# Altium schematic sheet UV_board.SchDoc
size A4
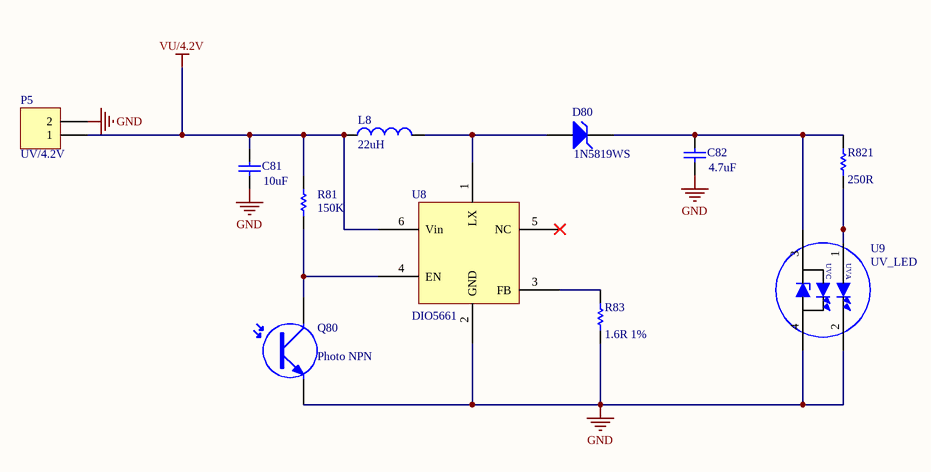
[diagram p0: UV_board.SchDoc]

## Parts
C81  value 10uF  [C0805]  (hidden comment: Cap)
C82  value 4.7uF  [C0402]  (hidden comment: Cap)
D80  1N5819WS  [SOD-323]
L8  value 22uH  [CD32]  (hidden comment: Inductor)
P5  UV/4.2V  [CON_1.25MM_2P]
Q80  Photo NPN  [PT0603]
R81  value 150K  [R0402]  (hidden comment: Res1)
R83  value 1.6R 1%  [R0402]  (hidden comment: Res1)
R821  value 250R  [R0402]  (hidden comment: Res1)
U8  DIO5661  [SOT23-6-1]
U9  UV_LED  [SH35AH]

## Nets
GND: C81.2 C82.2 P5.2 Q80.3(E) R83.1 U8.2(GND) U9.2(+) U9.4(+)
VU/4.2V: C81.1 L8.1 P5.1 R81.2 U8.6(Vin)
NetC82_1: C82.1 D80.2(K) R821.2 U9.3(+)
NetD80_1: D80.1(A) L8.2 U8.1(LX)
NetQ80_1: Q80.1(C) R81.1 U8.4(EN)
NetR83_2: R83.2 U8.3(FB)
NetR821_1: R821.1 U9.1(+)

Not connected (* = marked no-connect by the designer): U8 5(NC)*

## Notes on the sheet
- (in symbol UV_LED) UVC; UVA

## Library data of the parts
C81 C82 = Cap: 电容; Published: 8-Jun-2000; LatestRevisionDate: 17-Jul-2002; LatestRevisionNote: Re-released for DXP Platform.; PackageReference: RAD-0.3; Publisher: Altium Limited; PackageDescription: Radial Cap, Thru-Hole; 2 Leads; 0.3 in Pin Spacing
D80 = D Zener: 二极管; Published: 8-Jun-2000; LatestRevisionDate: 17-Jul-2002; LatestRevisionNote: Re-released for DXP Platform.; PackageReference: DIODE-0.7; Publisher: Altium Limited; PackageDescription: Diode, Thru-Hole; 2 Leads; 0.7 in Pin Spacing
L8 = Inductor: 功率电感; Code_IEC: 1005; Published: 8-Jun-2000; LatestRevisionDate: 29-May-2009; LatestRevisionNote: IPC-7351 Footprint Added.; PackageReference: 0402-A; Publisher: Altium Limited; PackageDescription: Chip Inductor; Code_JEITA: 0402
P5 = Header 2: UV灯电源接口; LatestRevisionDate: 17-Jul-2002; LatestRevisionNote: Re-released for DXP Platform.; Publisher: Altium Limited
Q80 = Photo NPN: 光敏三极管; Published: 24-Mar-1999; LatestRevisionDate: 17-Jul-2002; LatestRevisionNote: Re-released for DXP Platform.; PackageReference: TO-220_A; Publisher: Altium Limited; Code_JEDEC: TO-220-AC
R81 R83 R821 = Res1: 电阻; Published: 8-Jun-2000; LatestRevisionDate: 17-Jul-2002; LatestRevisionNote: Re-released for DXP Platform.; PackageReference: AXIAL-0.3; Publisher: Altium Limited; PackageDescription: Axial Device, Thru-Hole; 2 Leads; 0.3 in Pin Spacing
U8 = DIO5661: 恒流IC